# EAGLE design batteryholder3S2P_revA (EAGLE 9.5.1)

## Sheet 1 of 2
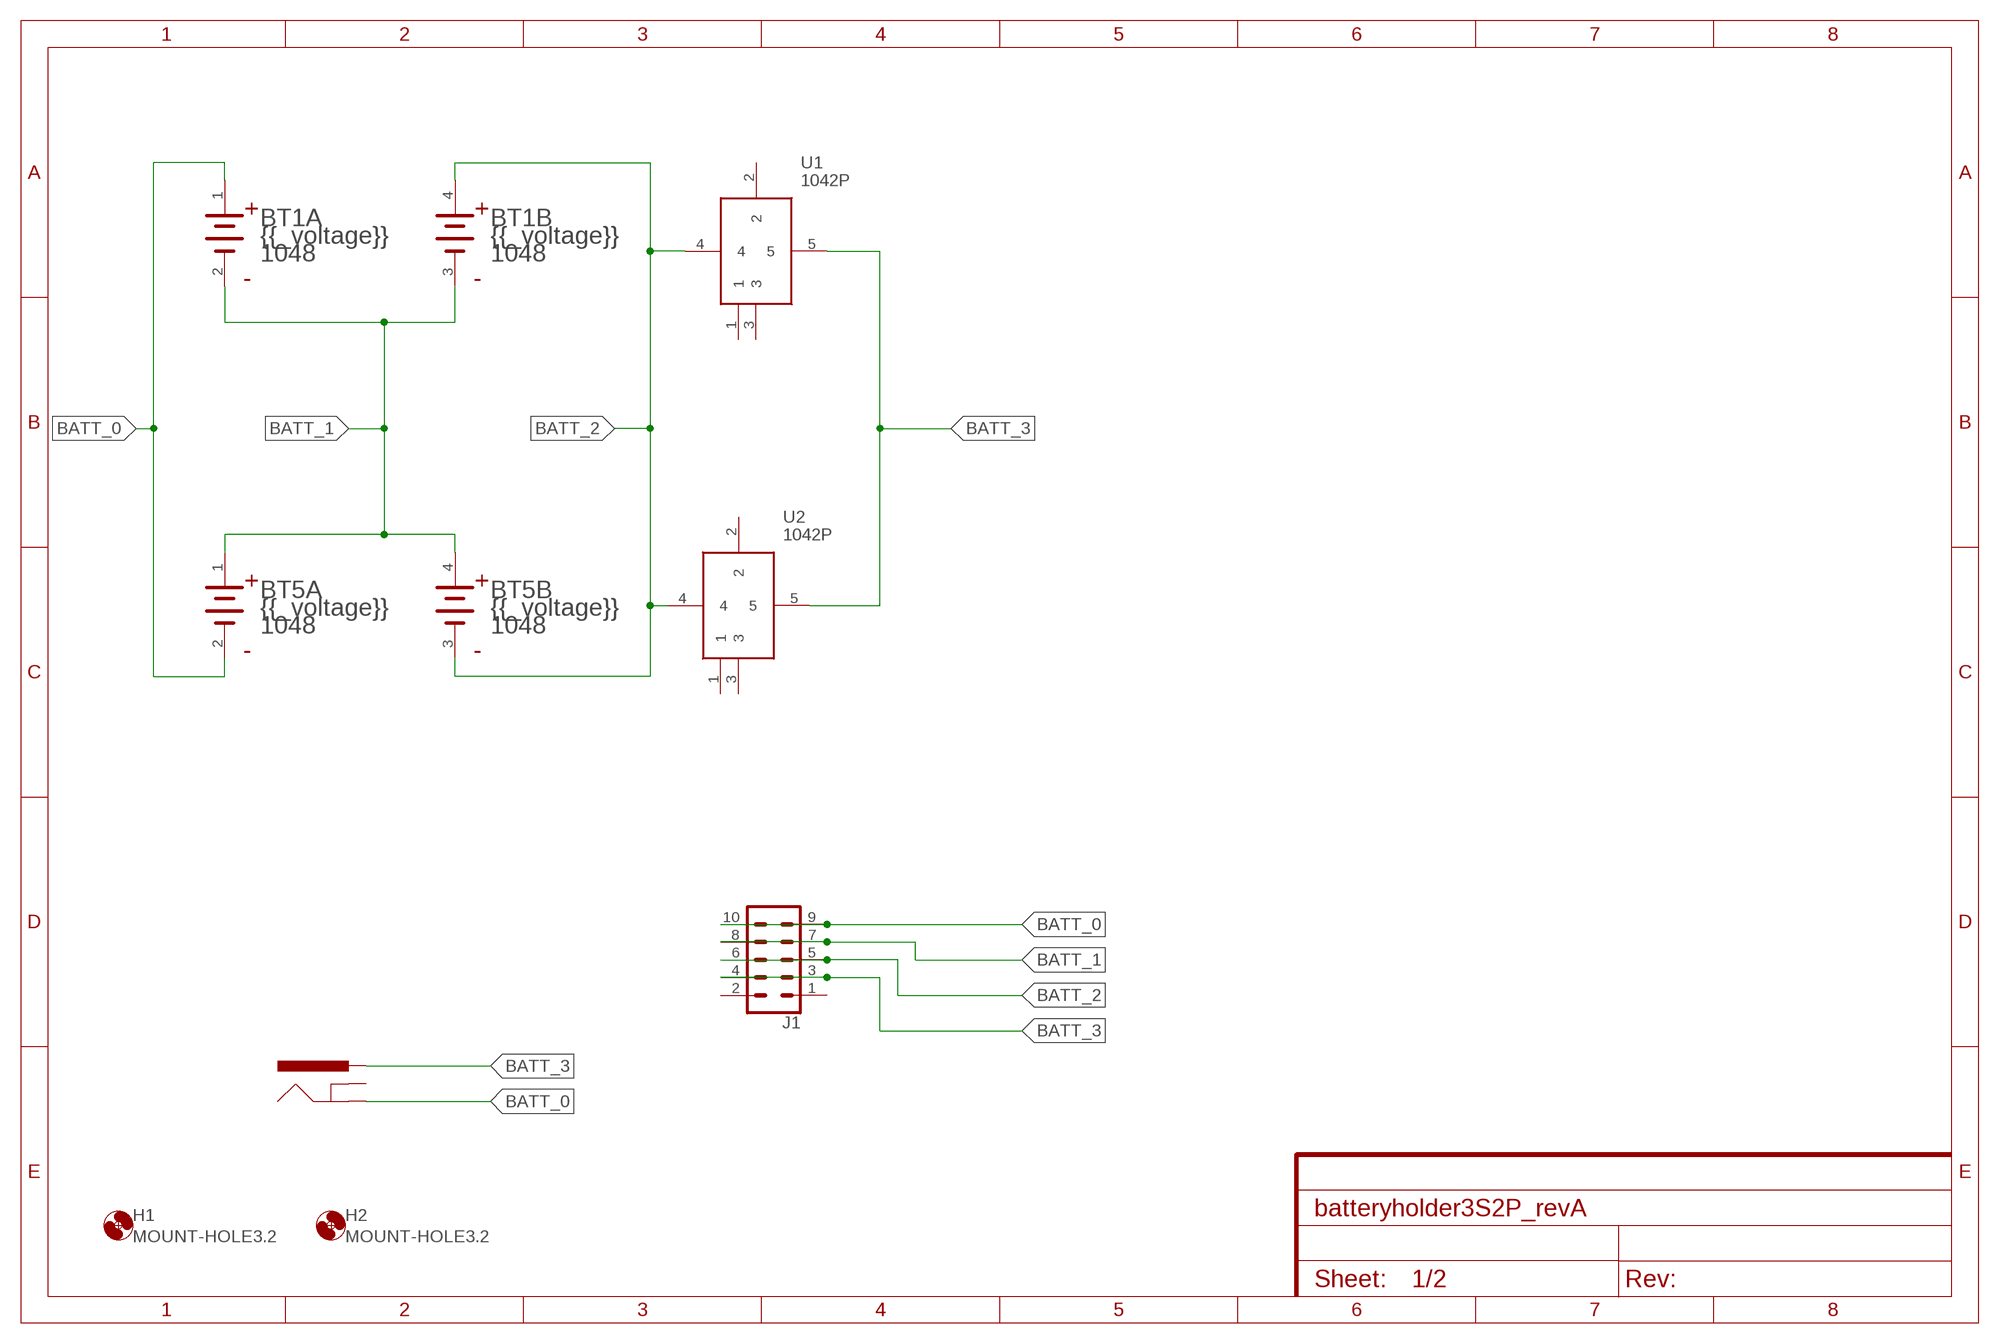
[diagram p0: schematic, sheet 1]

### Parts
BT1  KEYSTONE_1048KEYSTONE_1048_0_0  [KEYSTONE_1048_0]
BT5  KEYSTONE_1048KEYSTONE_1048_0_0  [KEYSTONE_1048_0]
H1  MOUNT-HOLE3.2  [3,2]
H2  MOUNT-HOLE3.2  [3,2]
J1  CONN_05X2SHD  [2X5-SHROUDED]
J3  POWER_JACKPTH_BREAD  [POWER_JACK_PTH_BREAD]
U1  1042P  [1042P]
U2  1042P  [1042P]

### Nets
BATT_0 [power]: BT1.1(A:1_ANODE) BT5.2(A:1_CATHODE) J1.9 J1.10 J3.GND
BATT_1 [power]: BT1.2(A:1_CATHODE) BT1.3(B:2_CATHODE) BT5.1(A:1_ANODE) BT5.4(B:2_ANODE) J1.7 J1.8
BATT_2 [power]: BT1.4(B:2_ANODE) BT5.3(B:2_CATHODE) J1.5 J1.6 U1.4 U2.4
BATT_3 [power]: J1.3 J1.4 J3.PWR U1.5 U2.5
Unconnected: J1.1 J1.2 J3.GNDBREAK U1.1 U1.2 U1.3 U2.1 U2.2 U2.3

## Sheet 2 of 2

## Library data of the parts
BT1 BT5 = Keystone - 1048:KEYSTONE_1048: SMT Holder for Dual 18650 Batteries; CENTROID_NOT_SPECIFIED: No; CONN_ORIENTATION: Horizontal; CONTACT_MATERIAL: Gold,Nickel; DATASHEET: https://www.keyelco.com/userAssets/file/M65p27.pdf; DEVICE_CLASS_L1: Connectors; DEVICE_CLASS_L2: unset; DEVICE_CLASS_L3: unset; DIGIKEY_DESCRIPTION: BATT HOLDER 18650 2 CELL SMD TAB; DIGIKEY_PART_NUMBER: 36-1048-ND; FOOTPRINT_URL: https://www.keyelco.com/product-pdf.cfm?p=920; HEIGHT: 0.595inch; LEAD_FREE: yes; MF: Keystone; MFG_PACKAGE_IDENT: 1048; MFG_PACKAGE_IDENT_DATE: 0; MFG_PACKAGE_IDENT_REV: 0; MOUSER_DESCRIPTION: Battery holder SMD Dimensions L x W x H: 86 x 39.78 x 14.86 mm Suitable for: 2 x 18650; MOUSER_PART_NUMBER: 534-1048; MPN: 1048; NUMBER_OF_CONTACTS: 2; PACKAGE: SMT_BTTHLDR_18650_DUAL; PREFIX: BT; ROHS: yes; TEMPERATURE_RANGE_HIGH: +145°C; TEMPERATURE_RANGE_LOW: -50°C; VERIFICATION_VERSION: 0.0.0.1
H1 H2 = holes:MOUNT-HOLE: MOUNTING HOLE with drill center marker
J1 = SparkFun-Connectors:CONN_05X2: Multi connection point. Often used as Generic Header-pin footprint for 0.1 inch spaced/style header connections For AVR SPI programming port, see special device with nice symbol: "AVR_SPI_PROG_5x2.dev" You can populate with any combo of single row headers, but if you'd like an exact match, check these: 2x5 AVR ICSP Male Header <https://www.sparkfun.com/products/778> (PRT-00778) 2x5 Pin Shrouded Header <https://www.sparkfun.com/products/8506> (PRT-08506) On any of the 0.1 inch spaced packages, you can populate with these: Break Away Headers - Straight <https://www.sparkfun.com/products/116> (PRT-00116) Break Away Male Headers - Right Angle <https://www.sparkfun.com/products/553> (PRT-00553) Female Headers <https://www.sparkfun.com/products/115> (PRT-00115) Break Away Headers - Machine Pin <https://www.sparkfun.com/products/117> (PRT-00117) Break Away Female Headers - Swiss Machine Pin <https://www.sparkfun.com/products/743> (PRT-00743) Special note: the shrouded connector mates well with our 5x2 ribbon cables: 2x5 Pin IDC Ribbon Cable <https://www.sparkfun.com/products/8535> (PRT-08535); PROD_ID: CONN-08671; SF_ID: PRT-08506
J3 = SparkFun-Connectors:POWER_JACK: Power Jack Connector This is the standard 5.5mm barrel jack for power. The PTH is the most common, proven, reliable, footprint. The Slot footprint only works if the mill layer is transmitted to the PCB fab house so be warned. Here are the connectors we sell at SparkFun: DC Barrel Power Jack/Connector <https://www.sparkfun.com/products/119> (PRT-00119) DC Barrel Power Jack/Connector (SMD) <https://www.sparkfun.com/products/12748> (PRT-12748) DC Barrel Jack Adapter - Breadboard Compatible <https://www.sparkfun.com/products/10811> (PRT-10811) It is used on this SparkFun product (and many, many others): SparkFun RedBoard - Programmed with Arduino <https://www.sparkfun.com/products/12757> (DEV-12757) Also, if you need a mating power supply or connector, please check these out: Wall Adapter Power Supply - 9VDC 650mA <https://www.sparkfun.com/products/298> (TOL-00298) DC Barrel Jack Adapter - Male <https://www.sparkfun.com/products/10287> (PRT-10287); PROD_ID: PRT-10811
U1 U2 = 1042P:1042P: KEYSTONE - 1042P - BATTERY HOLDER, 18650, SMD Source: Datasheet <http://www.keyelco.com/product-pdf.cfm?p=13957>; ALLIED_NUMBER: 71135189; ALLIED_PRICE-STOCK: https://www.alliedelec.com/keystone-electronics-1042p/71135189/; DESCRIPTION: KEYSTONE - 1042P - BATTERY HOLDER, 18650, SMD; HEIGHT: 14mm; MANUFACTURER_NAME: Keystone Electronics; MANUFACTURER_PART_NUMBER: 1042P; MOUSER_PART_NUMBER: 534-1042P; MOUSER_PRICE-STOCK: https://www.mouser.com/Search/Refine.aspx?Keyword=534-1042P

## Net classes
1 power: width 1.27 mm, clearance 1.27 mm

## Board
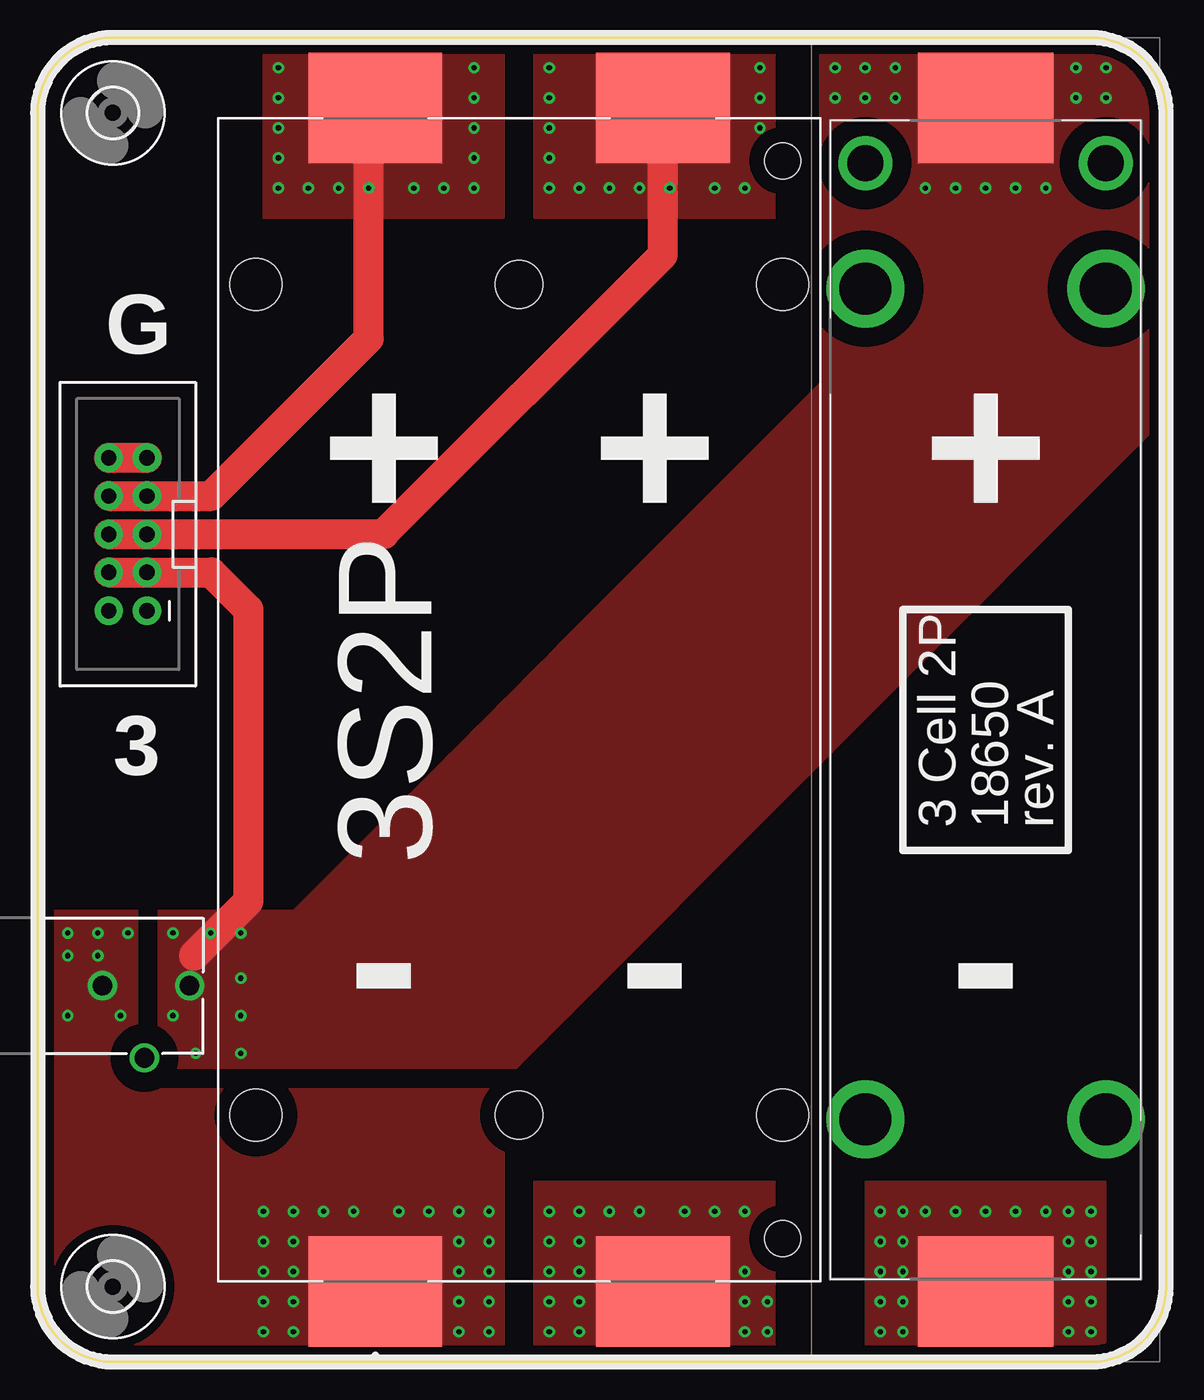
[diagram p1: board, top side]
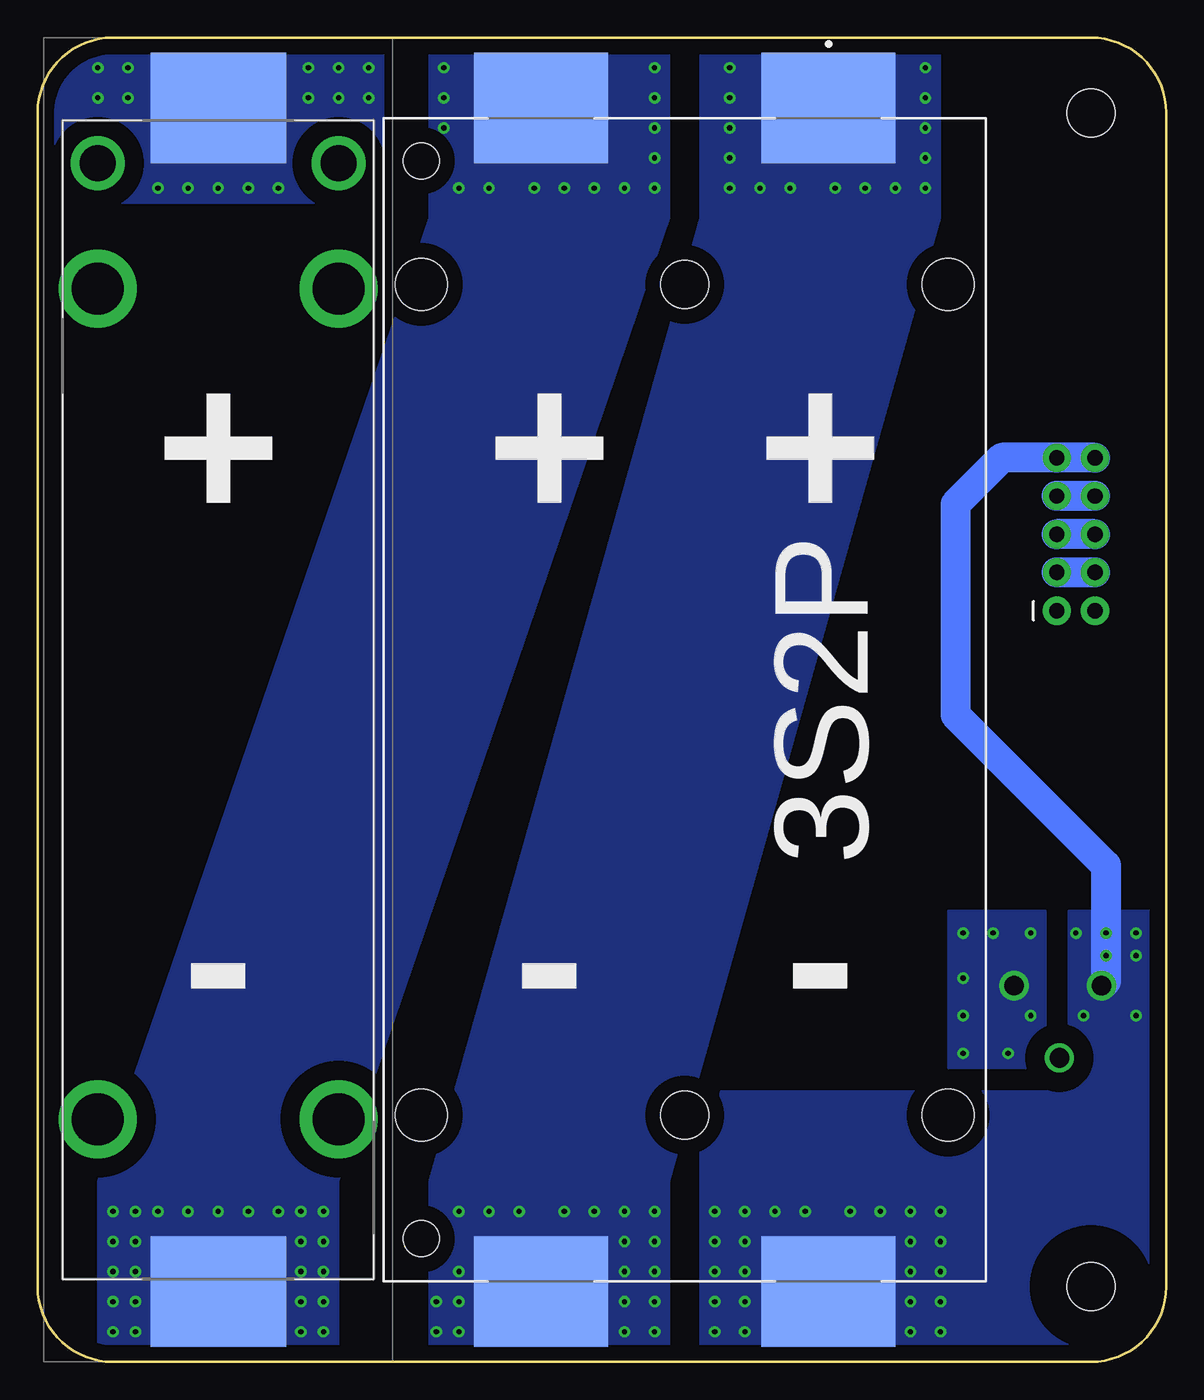
[diagram p2: board, bottom side, seen from below]

Size 75 x 88 mm. Coordinates in mm from the lower left corner, seen from the top.
Outline: 0,76 0,83 arc-90 5,88 70,88 arc-90 75,83 75,5 arc-90 70,0 5,0 arc-90 0,5 0,76.1
Copper layers (1*16): Top 0.035mm / dielectric 1.5mm / Bottom 0.035mm
Design rules "default": minimum track width 6mil, minimum drill 0.35mm, track to track 6mil, track to pad 6mil, pad to pad 6mil, via to via 6mil, smd to smd 6mil, copper to edge 40mil, drill to drill 6mil, minimum pad ring 10mil, minimum via ring 8mil, stop-mask expansion 4mil, vias tented up to drill 0mil, thermal gap 10mil

### Footprints (pad centres in the part's own frame; a part is rotated, then mirrored left to right if it is on the bottom)
KEYSTONE_1048_0 = smd 7.34 x 8.89: 1 -39.33,9.555; 2 39.33,9.555; 3 -39.33,-9.555; 4 39.33,-9.555 | hole 3.45: 27.6,17.505; -27.6,-17.505 | hole 2.39: 35.82,-17.505 | hole 3.17: 27.6,0; -27.6,0
3,2 = hole 3.2: 0,0
2X5-SHROUDED = drill 1.016 pad 1.88: 1 -1.27,5.08; 2 1.27,5.08; 3 -1.27,2.54; 4 1.27,2.54; 5 -1.27,0; 6 1.27,0; 7 -1.27,-2.54; 8 1.27,-2.54; 9 -1.27,-5.08; 10 1.27,-5.08
POWER_JACK_PTH_BREAD = drill 1.3: GND 0,7.9; GNDBREAK 4.8,10.7; PWR 0,13.7
1042P = drill 3.45 pad 5.175: 1 -27.87,-8; 2 27.33,8 | drill 2.39 pad 3.585: 3 35.66,-8 | smd 7.34 x 9: 4 -39.33,0; 5 39.33,0

### Placement (x,y rotation side)
BT1  32,44 90 top
BT5  32,44 270 bottom
H1  5,83 0 top
H2  5,5 0 top
J1  6,55 180 top
J3  -3.6,25 270 top
U1  63,44 90 top
U2  63,44 90 bottom

### Tracks (layer width: path | path; a pad name or v marks a point on that pad's centre or on a via)
BATT_0  (via drill 0.35)
  Top 2: J1.10 J1.9
  Bottom 2: J3.GND 4,25.3 4,33 14,43 14,57 10.92,60.08 J1.9 J1.10
  other vias: 5.5,23 2,28.5 4,28.5 2,27 4,27 2,23 6,28.5 30,2 30,4 30,6 30,8 30,10 28,10 26,10 24,10 21,10 19,10 17,10 15,10 15,8 15,6 15,4 15,2 28,4 28,6 28,8 28,2 17,2 17,4 17,6 17,8
  pour Top (rank 2, no thermals): 0,30 31,30 31,0 0,0
  pour Bottom (rank 2, no thermals): 0,18 0,0 31,0 31,18
  pour Bottom (no thermals): 6.5,0 0,0 0,30 6.5,30
BATT_1  (via drill 0.35)
  Top 2: BT5.1 22.67,83.33 23,83 22,82 22,68 11.54,57.54 J1.7 J1.8
  Bottom 2: J1.8 J1.7
  other vias: 16,86 16,84 16,82 16,80 16,78 18,78 29,78 29,80 29,82 29,84 29,86 27,78 25,78 20,78 48.5,2 48.5,4 47,4 47,2 36,2 34,2 34,4 36,4 34,6 34,8 34,10 36,8 47,6 36,6 36,10 38,10 40,10 47,10 45,10 43,10 22,78
  pour Top (no thermals): 15,88 15,76 31,76 31,88
  pour Top (no thermals): 33,0 33,12 49,12 49,0
  pour Bottom (no thermals): 15,88 15,76 33,12 33,0 49,0 49,12 31,76 31,88
BATT_2  (via drill 0.35)
  Top 2: BT5.3 41.55,73.56 23,55 J1.5 J1.6
  Bottom 2: J1.6 J1.5
  other vias: 34,86 34,84 34,82 34,80 34,78 36,78 38,78 40,78 48,86 48,84 48,82 47,78 45,78 42,78 70,2 70,4 70,6 70,8 70,10 68.5,2 68.5,4 68.5,6 68.5,8 68.5,10 67,10 65,10 56,10 56,8 56,6 56,4 56,2 57.5,2 57.5,4 57.5,6 57.5,8 57.5,10 59,10 61,10 63,10
  pour Top (no thermals): 33,88 33,76 49,76 49,88
  pour Top (no thermals): 55,0 55,12 71,12 71,0
  pour Bottom (no thermals): 33,88 33,76 55,12 55,0 71,0 71,12 49,76 49,88
BATT_3  (via drill 0.35)
  Top 2: 10.4,27 14,30.6 14,50 11.54,52.46 J1.3 J1.4
  Bottom 2: J1.4 J1.3
  other vias: 9,28.5 9,23 10.5,20.5 13.5,25.5 13.5,20.5 13.5,28.5 11.5,28.5 53,86 55,86 57,86 57,84 55,84 53,84 69,84 71,84 69,86 71,86 67,78 65,78 63,78 61,78 59,78 13.5,23
  pour Top (no thermals): 75,88 52,88 52,65 17,30 8,30 8,19.5 31.8,19.5 75,62.79
  pour Bottom (no thermals): 52,88 52,77 75,77 75,88
  pour Bottom (no thermals): 8,30 8,19.5 14.5,19.5 14.5,30

### Text on the board
tPlace: G | + | + | + | 3S2P | 3 | 3 Cell 2P | 18650 | rev. A | - | - | -
bPlace: + | + | + | 3S2P | - | - | -